# Altium schematic sheet DW1000.SchDoc: DecaWave DW1000
size A4; CompanyName: SPAN; Engineer: Anh Luong; Organization: University of Utah; Address1: 50 S Central Campus Dr; Address2: MEB Rm 3129; Address3: Salt Lake City, Utah 84115; Address4: USA; Revision: 1; SheetNumber: 1; SheetTotal: 2
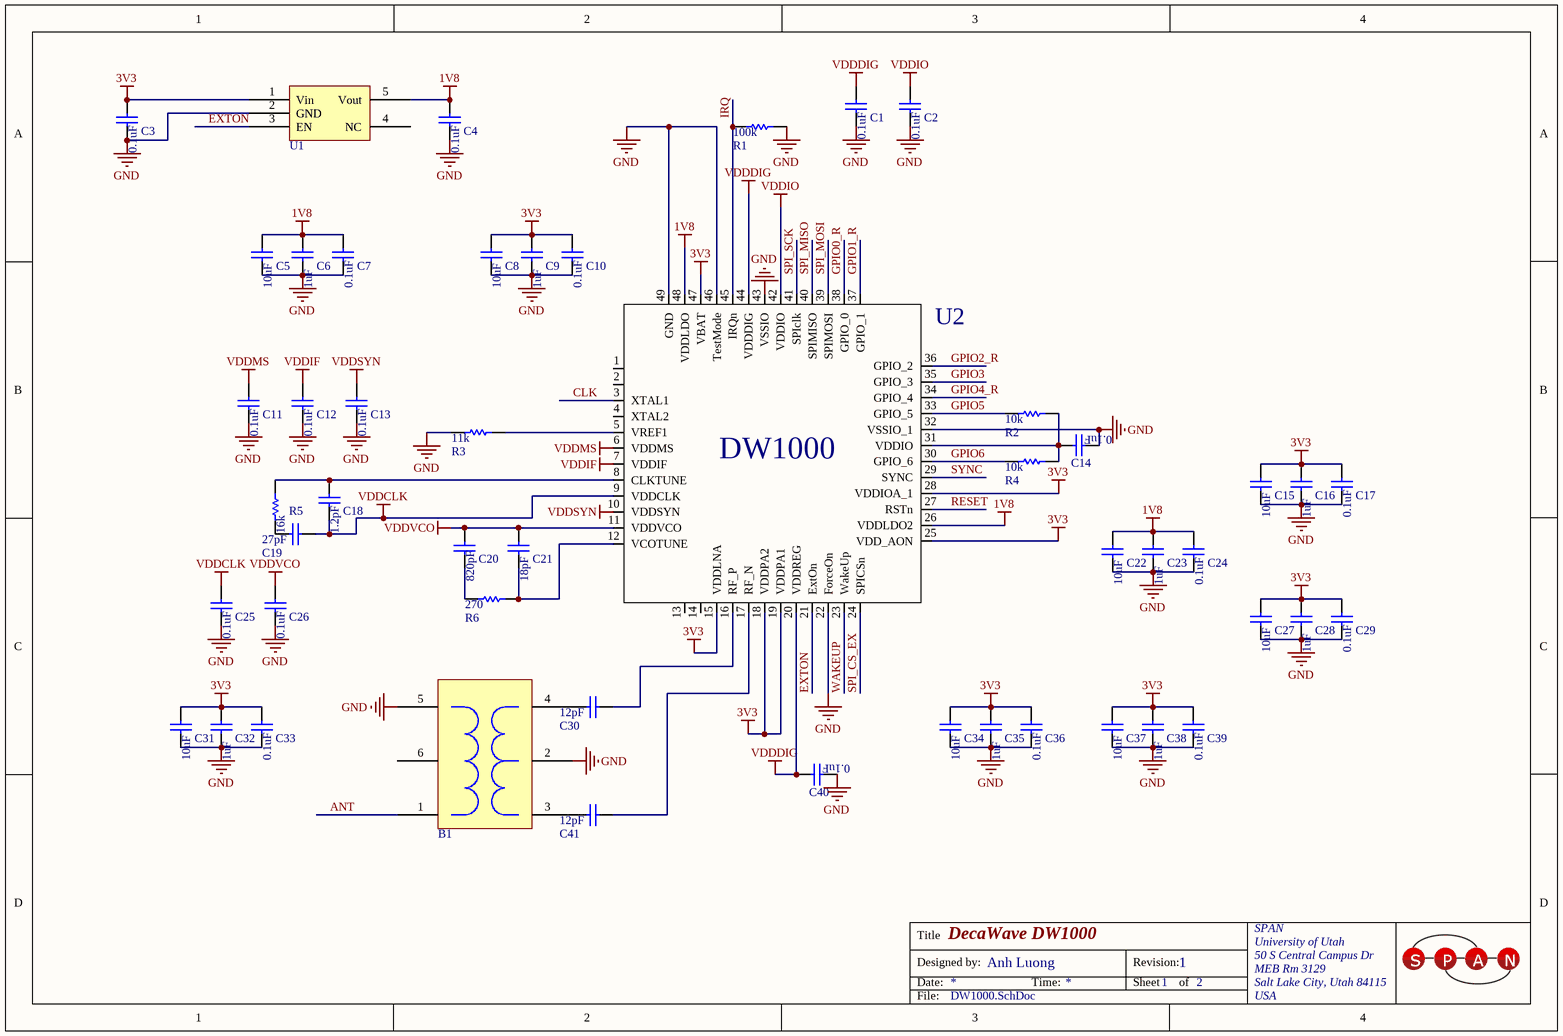
[diagram p0: DW1000.SchDoc]

## Parts
B1  HHM1595A1  [BALUN]  (value not drawn)
C1  GRM188R71C104KA01D  [CAPC1608X08N (0603)]  (value not drawn)
C2  GRM188R71C104KA01D  [CAPC1608X08N (0603)]  (value not drawn)
C3  GRM188R71C104KA01D  [CAPC1608X08N (0603)]  (value not drawn)
C4  GRM188R71C104KA01D  [CAPC1608X08N (0603)]  (value not drawn)
C5  GRM188R60J106ME47D  [CAPC1608X08N (0603)]  (value not drawn)
C6  GRM188R61A105KA61D  [CAPC1608X08N (0603)]  (value not drawn)
C7  GRM188R71C104KA01D  [CAPC1608X08N (0603)]  (value not drawn)
C8  GRM188R60J106ME47D  [CAPC1608X08N (0603)]  (value not drawn)
C9  GRM188R61A105KA61D  [CAPC1608X08N (0603)]  (value not drawn)
C10  GRM188R71C104KA01D  [CAPC1608X08N (0603)]  (value not drawn)
C11  GRM188R71C104KA01D  [CAPC1608X08N (0603)]  (value not drawn)
C12  GRM188R71C104KA01D  [CAPC1608X08N (0603)]  (value not drawn)
C13  GRM188R71C104KA01D  [CAPC1608X08N (0603)]  (value not drawn)
C14  GRM188R71C104KA01D  [CAPC1608X08N (0603)]  (value not drawn)
C15  GRM188R60J106ME47D  [CAPC1608X08N (0603)]  (value not drawn)
C16  GRM188R61A105KA61D  [CAPC1608X08N (0603)]  (value not drawn)
C17  GRM188R71C104KA01D  [CAPC1608X08N (0603)]  (value not drawn)
C18  GRM1885C1H1R2CA01D  [CAPC1608X08N (0603)]  (value not drawn)
C19  GRM1885C1H270JA01D  [CAPC1608X08N (0603)]  (value not drawn)
C20  GRM188R71H821KA01D  [CAPC1608X08N (0603)]  (value not drawn)
C21  GRM1885C1H180JA01D  [CAPC1608X08N (0603)]  (value not drawn)
C22  GRM188R60J106ME47D  [CAPC1608X08N (0603)]  (value not drawn)
C23  GRM188R61A105KA61D  [CAPC1608X08N (0603)]  (value not drawn)
C24  GRM188R71C104KA01D  [CAPC1608X08N (0603)]  (value not drawn)
C25  GRM188R71C104KA01D  [CAPC1608X08N (0603)]  (value not drawn)
C26  GRM188R71C104KA01D  [CAPC1608X08N (0603)]  (value not drawn)
C27  GRM188R60J106ME47D  [CAPC1608X08N (0603)]  (value not drawn)
C28  GRM188R61A105KA61D  [CAPC1608X08N (0603)]  (value not drawn)
C29  GRM188R71C104KA01D  [CAPC1608X08N (0603)]  (value not drawn)
C30  GRM1885C1H120JA01D  [CAPC1608X08N (0603)]  (value not drawn)
C31  GRM188R60J106ME47D  [CAPC1608X08N (0603)]  (value not drawn)
C32  GRM188R61A105KA61D  [CAPC1608X08N (0603)]  (value not drawn)
C33  GRM188R71C104KA01D  [CAPC1608X08N (0603)]  (value not drawn)
C34  GRM188R60J106ME47D  [CAPC1608X08N (0603)]  (value not drawn)
C35  GRM188R61A105KA61D  [CAPC1608X08N (0603)]  (value not drawn)
C36  GRM188R71C104KA01D  [CAPC1608X08N (0603)]  (value not drawn)
C37  GRM188R60J106ME47D  [CAPC1608X08N (0603)]  (value not drawn)
C38  GRM188R61A105KA61D  [CAPC1608X08N (0603)]  (value not drawn)
C39  GRM188R71C104KA01D  [CAPC1608X08N (0603)]  (value not drawn)
C40  GRM188R71C104KA01D  [CAPC1608X08N (0603)]  (value not drawn)
C41  GRM1885C1H120JA01D  [CAPC1608X08N (0603)]  (value not drawn)
R1  MCR03ERTJ104  [RESC1608X06N (0603)]  (value not drawn)
R2  MCR03ERTJ103  [RESC1608X06N (0603)]  (value not drawn)
R3  MCR03ERTJ113  [RESC1608X06N (0603)]  (value not drawn)
R4  MCR03ERTJ103  [RESC1608X06N (0603)]  (value not drawn)
R5  MCR03ERTJ163  [RESC1608X06N (0603)]  (value not drawn)
R6  MCR03ERTJ271  [RESC1608X06N (0603)]  (value not drawn)
U1  LP5907MFX-1.8/NOPB  [SOT95P280X145-5N]  (value not drawn)
U2  DW1000 IC  [QFN-48]  (value not drawn)

## Nets
1V8: C4.2 C5.2 C6.2 C7.2 C22.2 C23.2 C24.2 U1.5(Vout) U2.26(VDDLDO2) U2.48(VDDLDO)
3V3: C3.2 C8.2 C9.2 C10.2 C15.2 C16.2 C17.2 C27.2 C28.2 C29.2 C31.2 C32.2 C33.2 C34.2 C35.2 C36.2 C37.2 C38.2 C39.2 U1.1(Vin) U2.15(VDDLNA) U2.18(VDDPA2) U2.19(VDDPA1) U2.25(VDD_AON) U2.28(VDDIOA_1) U2.47(VBAT)
GND: B1.2 B1.5 C1.1 C2.1 C3.1 C4.1 C5.1 C6.1 C7.1 C8.1 C9.1 C10.1 C11.1 C12.1 C13.1 C14.1 C15.1 C16.1 C17.1 C22.1 C23.1 C24.1 C25.1 C26.1 C27.1 C28.1 C29.1 C31.1 C32.1 C33.1 C34.1 C35.1 C36.1 C37.1 C38.1 C39.1 C40.1 R1.2 R3.1 U1.2(GND) U2.22(ForceOn) U2.32(VSSIO_1) U2.43(VSSIO) U2.46(TestMode) U2.49(GND)
VDDCLK: C18.1 C19.2 C25.2 U2.9(VDDCLK)
VDDDIG: C1.2 C40.2 U2.20(VDDREG) U2.44(VDDDIG)
VDDIF: C12.2 U2.7(VDDIF)
VDDIO: C2.2 U2.42(VDDIO)
VDDMS: C11.2 U2.6(VDDMS)
VDDSYN: C13.2 U2.10(VDDSYN)
VDDVCO: C20.2 C21.2 C26.2 U2.11(VDDVCO)
ANT: B1.1
CLK: U2.3(XTAL1)
EXTON: U1.3(EN) U2.21(ExtOn)
GPIO0_R: U2.38(GPIO_0)
GPIO1_R: U2.37(GPIO_1)
GPIO2_R: U2.36(GPIO_2)
GPIO3: U2.35(GPIO_3)
GPIO4_R: U2.34(GPIO_4)
GPIO5: R2.1 U2.33(GPIO_5)
GPIO6: R4.1 U2.30(GPIO_6)
IRQ: R1.1 U2.45(IRQn)
RESET: U2.27(RSTn)
SPI_CS_EX: U2.24(SPICSn)
SPI_MISO: U2.40(SPIMISO)
SPI_MOSI: U2.39(SPIMOSI)
SPI_SCK: U2.41(SPIclk)
SYNC: U2.29(SYNC)
WAKEUP: U2.23(WakeUp)
NetB1_3: B1.3 C41.1
NetB1_4: B1.4 C30.1
NetC14_2: C14.2 R2.2 R4.2 U2.31(VDDIO)
NetC18_2: C18.2 R5.2 U2.8(CLKTUNE)
NetC19_1: C19.1 R5.1
NetC20_1: C20.1 R6.1
NetC21_1: C21.1 R6.2 U2.12(VCOTUNE)
NetC30_2: C30.2 U2.16(RF_P)
NetC41_2: C41.2 U2.17(RF_N)
NetR3_2: R3.2 U2.5(VREF1)

Not connected (* = marked no-connect by the designer): B1 6; U1 4(NC); U2 1 2 4(XTAL2) 13 14

## Notes on the sheet
- Title
- Designed by:
- Date:
- Time:
- Revision:
- Sheet
- of
- File:
- (in symbol DW1000_QFN_48) DW1000
- (in symbol GRM188R60J106ME47D) 10uF
- (in symbol GRM188R61A105KA61D) 1uF
- (in symbol GRM188R71C104KA01D) 0.1uF

## Library data of the parts
B1 = HHM1595A1: XFMR BALUN RF 3.0-8.0GHZ UWB SMD; Manufacturer: TDK Corporation; Frequency Range: 3GHz ~ 8GHz; Impedance - Unbalanced/Balanced: 50 / 100 Ohm; Phase Difference: 180° ±20; Insertion Loss (Max): 1.5dB; Return Loss (Min): 8dB; Supplier 1: Digi-Key; Manufacturer Part Number: HHM1595A1; RoHS: RoHS Compliant; Category: RF/IF and RFID; Stock 1: 20610; Pricing 1: 1=1.38, 10=1.348, 100=0.7356, 250=0.66, 500=0.64626, 1000=0.4675 (USD); Packaging: Cut Tape (CT); Part Status: Active; Package / Case: 0805 (2012 Metric); Mounting Type: Surface Mount; ComponentLink1URL: https://product.tdk.com/info/en/documents/data_sheet/rf_balun_hhm1595a1_en.pdf; ComponentLink1Description: https://product.tdk.com/info/en/documents/data_sheet/rf_balun_hhm1595a1_en.pdf; Supplier Part Number 1: 445-3387-1-ND
C1-C4 C7 C10-C14 C17 C24-C26 C29 C33 C36 C39 C40 = GRM188R71C104KA01D: CAP CER 0.1UF 16V 10% X7R 0603; Manufacturer: Murata Electronics North America; Capacitance: 0.1µF; Supplier 1: Digi-Key; Manufacturer Part Number: GRM188R71C104KA01D; RoHS: RoHS Compliant; Category: Capacitors; Stock 1: 1458181; Pricing 1: 1=0.1, 10=0.019, 50=0.0102, 100=0.0086, 250=0.00704, 500=0.006, 1000=0.00468 (USD); Packaging: Cut Tape (CT); Tolerance: ±10%; Voltage - Rated: 16V; Temperature Coefficient: X7R; Mounting Type: Surface Mount, MLCC; Operating Temperature: -55°C ~ 125°C; Applications: General Purpose; Ratings: -; Package / Case: 0603 (1608 Metric); Size / Dimension: 0.063" L x 0.031" W (1.60mm x 0.80mm); Height - Seated (Max): -; Thickness (Max): 0.035" (0.90mm); Lead Spacing: -; Features: -; Lead Style: -; ComponentLink1URL: http://search.murata.co.jp/Ceramy/image/img/A01X/G101/ENG/GRM188R71C104KA01-01.pdf; ComponentLink1Description: http://search.murata.co.jp/Ceramy/image/img/A01X/G101/ENG/GRM188R71C104KA01-01.pdf
C5 C8 C15 C22 C27 C31 C34 C37 = GRM188R60J106ME47D: CAP CER 10UF 6.3V 20% X5R 0603; Manufacturer: Murata Electronics North America; Capacitance: 10µF; Supplier 1: Digi-Key; Manufacturer Part Number: GRM188R60J106ME47D; RoHS: RoHS Compliant; Category: Capacitors; Stock 1: 2128324; Pricing 1: 1=0.24, 10=0.2, 50=0.1126, 100=0.1, 250=0.075, 500=0.06626, 1000=0.05875 (USD); Packaging: Digi-Reel®; Voltage - Rated: 6.3V; Tolerance: ±20%; Temperature Coefficient: X5R; Mounting Type: Surface Mount, MLCC; Operating Temperature: -55°C ~ 85°C; Applications: General Purpose; Ratings: -; Package / Case: 0603 (1608 Metric); Size / Dimension: 0.063" L x 0.031" W (1.60mm x 0.80mm); Height - Seated (Max): -; Thickness (Max): 0.035" (0.90mm); Lead Spacing: -; Features: -; Lead Style: -; ComponentLink1URL: http://search.murata.co.jp/Ceramy/image/img/A01X/G101/ENG/GRM188R60J106ME47-01.pdf; ComponentLink1Description: http://search.murata.co.jp/Ceramy/image/img/A01X/G101/ENG/GRM188R60J106ME47-01.pdf; Supplier 2: Digi-Key
C6 C9 C16 C23 C28 C32 C35 C38 = GRM188R61A105KA61D: CAP CER 1UF 10V 10% X5R 0603; Manufacturer: Murata Electronics North America; Capacitance: 1.0µF; Supplier 1: Digi-Key; Manufacturer Part Number: GRM188R61A105KA61D; RoHS: RoHS Compliant; Category: Capacitors; Stock 1: 244919; Pricing 1: 1=0.1, 10=0.041, 50=0.0224, 100=0.019, 250=0.01552, 500=0.01328, 1000=0.01035 (USD); Packaging: Cut Tape (CT); Voltage - Rated: 10V; Tolerance: ±10%; Temperature Coefficient: X5R; Mounting Type: Surface Mount, MLCC; Operating Temperature: -55°C ~ 85°C; Applications: General Purpose; Ratings: -; Package / Case: 0603 (1608 Metric); Size / Dimension: 0.063" L x 0.031" W (1.60mm x 0.80mm); Height - Seated (Max): -; Thickness (Max): 0.035" (0.90mm); Lead Spacing: -; Features: -; Lead Style: -; ComponentLink1URL: http://search.murata.co.jp/Ceramy/image/img/A01X/G101/ENG/GRM188R61A105KA61-01.pdf; ComponentLink1Description: http://search.murata.co.jp/Ceramy/image/img/A01X/G101/ENG/GRM188R61A105KA61-01.pdf
C18 = GRM1885C1H1R2CA01D: CAP CER 1.2PF 50V NP0 0603; Manufacturer: Murata Electronics North America; Tolerance: ±0.25pF; Temperature Coefficient: C0G, NP0; Supplier 1: Digi-Key; Manufacturer Part Number: GRM1885C1H1R2CA01D; RoHS: RoHS Compliant; Category: Capacitors; Stock 1: 36680; Pricing 1: 1=0.1, 10=0.053, 50=0.0286, 100=0.0242, 250=0.0198, 500=0.01694, 1000=0.0132 (USD); Packaging: Cut Tape (CT); Part Status: Active; Capacitance: 1.2pF; Voltage - Rated: 50V; Operating Temperature: -55°C ~ 125°C; Features: -; Ratings: -; Applications: General Purpose; Failure Rate: *; Mounting Type: Surface Mount, MLCC; Package / Case: 0603 (1608 Metric); Size / Dimension: 0.063" L x 0.031" W (1.60mm x 0.80mm); Height - Seated (Max): -; Thickness (Max): 0.035" (0.90mm); Lead Spacing: -; Lead Style: -; ComponentLink1URL: http://www.murata.com/~/media/webrenewal/support/library/catalog/products/capacitor/mlcc/c02e.pdf; ComponentLink1Description: http://www.murata.com/~/media/webrenewal/support/library/catalog/products/capacitor/mlcc/c02e.pdf; Supplier Part Number 1: 490-10709-1-ND
C19 = GRM1885C1H270JA01D: CAP CER 27PF 50V NP0 0603; Manufacturer: Murata Electronics North America; Tolerance: ±5%; Temperature Coefficient: C0G, NP0; Supplier 1: Digi-Key; Manufacturer Part Number: GRM1885C1H270JA01D; RoHS: RoHS Compliant; Category: Capacitors; Stock 1: 113117; Pricing 1: 1=0.1, 10=0.041, 50=0.0222, 100=0.0187, 250=0.01532, 500=0.0131, 1000=0.0102 (USD); Packaging: Cut Tape (CT); Part Status: Active; Capacitance: 27pF; Voltage - Rated: 50V; Operating Temperature: -55°C ~ 125°C; Features: -; Ratings: -; Applications: General Purpose; Failure Rate: *; Mounting Type: Surface Mount, MLCC; Package / Case: 0603 (1608 Metric); Size / Dimension: 0.063" L x 0.031" W (1.60mm x 0.80mm); Height - Seated (Max): -; Thickness (Max): 0.035" (0.90mm); Lead Spacing: -; Lead Style: -; ComponentLink1URL: http://www.murata.com/~/media/webrenewal/support/library/catalog/products/capacitor/mlcc/c02e.pdf; ComponentLink1Description: http://www.murata.com/~/media/webrenewal/support/library/catalog/products/capacitor/mlcc/c02e.pdf; Supplier Part Number 1: 490-1413-1-ND
C20 = GRM188R71H821KA01D: CAP CER 820PF 50V X7R 0603; Manufacturer: Murata Electronics North America; Tolerance: ±10%; Supplier 1: Digi-Key; Manufacturer Part Number: GRM188R71H821KA01D; RoHS: RoHS Compliant; Category: Capacitors; Stock 1: 61936; Pricing 1: 1=0.1, 10=0.067, 25=0.0476, 50=0.0364, 100=0.0308, 250=0.0252, 500=0.02156, 1000=0.0168 (USD); Packaging: Cut Tape (CT); Part Status: Active; Capacitance: 820pF; Voltage - Rated: 50V; Temperature Coefficient: X7R; Operating Temperature: -55°C ~ 125°C; Features: -; Ratings: -; Applications: General Purpose; Failure Rate: *; Mounting Type: Surface Mount, MLCC; Package / Case: 0603 (1608 Metric); Size / Dimension: 0.063" L x 0.031" W (1.60mm x 0.80mm); Height - Seated (Max): -; Thickness (Max): 0.035" (0.90mm); Lead Spacing: -; Lead Style: -; ComponentLink1URL: http://www.murata.com/~/media/webrenewal/support/library/catalog/products/capacitor/mlcc/c02e.pdf; ComponentLink1Description: http://www.murata.com/~/media/webrenewal/support/library/catalog/products/capacitor/mlcc/c02e.pdf; Supplier Part Number 1: 490-1493-1-ND
C21 = GRM1885C1H180JA01D: CAP CER 18PF 50V NP0 0603; Manufacturer: Murata Electronics North America; Tolerance: ±5%; Temperature Coefficient: C0G, NP0; Supplier 1: Digi-Key; Manufacturer Part Number: GRM1885C1H180JA01D; RoHS: RoHS Compliant; Category: Capacitors; Stock 1: 281577; Pricing 1: 1=0.1, 10=0.041, 50=0.0222, 100=0.0187, 250=0.01532, 500=0.0131, 1000=0.0102 (USD); Packaging: Cut Tape (CT); Part Status: Active; Capacitance: 18pF; Voltage - Rated: 50V; Operating Temperature: -55°C ~ 125°C; Features: -; Ratings: -; Applications: General Purpose; Failure Rate: *; Mounting Type: Surface Mount, MLCC; Package / Case: 0603 (1608 Metric); Size / Dimension: 0.063" L x 0.031" W (1.60mm x 0.80mm); Height - Seated (Max): -; Thickness (Max): 0.035" (0.90mm); Lead Spacing: -; Lead Style: -; ComponentLink1URL: http://www.murata.com/~/media/webrenewal/support/library/catalog/products/capacitor/mlcc/c02e.pdf; ComponentLink1Description: http://www.murata.com/~/media/webrenewal/support/library/catalog/products/capacitor/mlcc/c02e.pdf; Supplier Part Number 1: 490-1409-1-ND
C30 C41 = GRM1885C1H120JA01D: CAP CER 12PF 50V NP0 0603; Manufacturer: Murata Electronics North America; Tolerance: ±5%; Temperature Coefficient: C0G, NP0; Supplier 1: Digi-Key; Manufacturer Part Number: GRM1885C1H120JA01D; RoHS: RoHS Compliant; Category: Capacitors; Stock 1: 151484; Pricing 1: 1=0.1, 10=0.041, 50=0.0222, 100=0.0187, 250=0.01532, 500=0.0131, 1000=0.0102 (USD); Packaging: Cut Tape (CT); Part Status: Active; Capacitance: 12pF; Voltage - Rated: 50V; Operating Temperature: -55°C ~ 125°C; Features: -; Ratings: -; Applications: General Purpose; Failure Rate: *; Mounting Type: Surface Mount, MLCC; Package / Case: 0603 (1608 Metric); Size / Dimension: 0.063" L x 0.031" W (1.60mm x 0.80mm); Height - Seated (Max): -; Thickness (Max): 0.035" (0.90mm); Lead Spacing: -; Lead Style: -; ComponentLink1URL: http://www.murata.com/~/media/webrenewal/support/library/catalog/products/capacitor/mlcc/c02e.pdf; ComponentLink1Description: http://www.murata.com/~/media/webrenewal/support/library/catalog/products/capacitor/mlcc/c02e.pdf; Supplier Part Number 1: 490-1405-1-ND
R1 = MCR03ERTJ104: RES SMD 100K OHM 5% 1/10W 0603; Manufacturer: Rohm Semiconductor; Power (Watts): 0.1W, 1/10W; Temperature Coefficient: ±200ppm/°C; Supplier 1: Digi-Key; Manufacturer Part Number: MCR03ERTJ104; RoHS: RoHS Compliant; Category: Resistors; Stock 1: 136580; Pricing 1: 1=0.1, 10=0.019, 25=0.0132, 100=0.0075, 250=0.00576, 500=0.0046, 1000=0.00338 (USD); Packaging: Cut Tape (CT); Part Status: Active; Resistance (Ohms): 100k; Tolerance: ±5%; Composition: Thick Film; Features: -; Operating Temperature: -55°C ~ 155°C; Package / Case: 0603 (1608 Metric); Supplier Device Package: 0603; Size / Dimension: 0.063" L x 0.031" W (1.60mm x 0.80mm); Height: 0.022" (0.55mm); Number of Terminations: 2; Failure Rate: -; ComponentLink1URL: http://rohmfs.rohm.com/en/products/databook/datasheet/passive/resistor/chip_resistor/mcr_g.pdf; ComponentLink1Description: http://rohmfs.rohm.com/en/products/databook/datasheet/passive/resistor/chip_resistor/mcr_g.pdf; Supplier Part Number 1: RHM100KCGCT-ND
R2 R4 = MCR03ERTJ103: RES 10K OHM 1/10W 5% 0603 SMD; Manufacturer: Rohm Semiconductor; Power (Watts): 0.1W, 1/10W; Temperature Coefficient: ±200ppm/°C; Supplier 1: Digi-Key; Manufacturer Part Number: MCR03ERTJ103; RoHS: RoHS Compliant; Category: Resistors; Stock 1: 330000; Pricing 1: 5000=0.00103, 10000=0.00089, 25000=0.00078, 50000=0.00072, 125000=0.0007 (USD); Packaging: Tape & Reel (TR); Resistance (Ohms): 10k; Tolerance: ±5%; Composition: Thick Film; Features: -; Package / Case: 0603 (1608 Metric); Supplier Device Package: 0603 (1608 Metric); Size / Dimension: 0.063" L x 0.031" W (1.60mm x 0.80mm); Height: 0.022" (0.55mm); Number of Terminations: 2; ComponentLink1URL: http://rohmfs.rohm.com/en/products/databook/datasheet/passive/resistor/chip_resistor/mcr_g.pdf; ComponentLink1Description: http://rohmfs.rohm.com/en/products/databook/datasheet/passive/resistor/chip_resistor/mcr_g.pdf
R3 = MCR03ERTJ113: RES SMD 11K OHM 5% 1/10W 0603; Manufacturer: Rohm Semiconductor; Power (Watts): 0.1W, 1/10W; Temperature Coefficient: ±200ppm/°C; Supplier 1: Digi-Key; Manufacturer Part Number: MCR03ERTJ113; RoHS: RoHS Compliant; Category: Resistors; Stock 1: 8319; Pricing 1: 1=0.1, 10=0.019, 25=0.0132, 100=0.0075, 250=0.00576, 500=0.0046, 1000=0.00338 (USD); Packaging: Cut Tape (CT); Part Status: Active; Resistance (Ohms): 11k; Tolerance: ±5%; Composition: Thick Film; Features: -; Operating Temperature: -55°C ~ 155°C; Package / Case: 0603 (1608 Metric); Supplier Device Package: 0603; Size / Dimension: 0.063" L x 0.031" W (1.60mm x 0.80mm); Height: 0.022" (0.55mm); Number of Terminations: 2; Failure Rate: -; ComponentLink1URL: http://rohmfs.rohm.com/en/products/databook/datasheet/passive/resistor/chip_resistor/mcr_g.pdf; ComponentLink1Description: http://rohmfs.rohm.com/en/products/databook/datasheet/passive/resistor/chip_resistor/mcr_g.pdf; Supplier Part Number 1: RHM11KCGCT-ND
R5 = MCR03ERTJ163: RES SMD 16K OHM 5% 1/10W 0603; Manufacturer: Rohm Semiconductor; Power (Watts): 0.1W, 1/10W; Temperature Coefficient: ±200ppm/°C; Supplier 1: Digi-Key; Manufacturer Part Number: MCR03ERTJ163; RoHS: RoHS Compliant; Category: Resistors; Stock 1: 7457; Pricing 1: 1=0.1, 10=0.019, 25=0.0132, 100=0.0075, 250=0.00576, 500=0.0046, 1000=0.00338 (USD); Packaging: Cut Tape (CT); Part Status: Active; Resistance (Ohms): 16k; Tolerance: ±5%; Composition: Thick Film; Features: -; Operating Temperature: -55°C ~ 155°C; Package / Case: 0603 (1608 Metric); Supplier Device Package: 0603; Size / Dimension: 0.063" L x 0.031" W (1.60mm x 0.80mm); Height: 0.022" (0.55mm); Number of Terminations: 2; Failure Rate: -; ComponentLink1URL: http://rohmfs.rohm.com/en/products/databook/datasheet/passive/resistor/chip_resistor/mcr_g.pdf; ComponentLink1Description: http://rohmfs.rohm.com/en/products/databook/datasheet/passive/resistor/chip_resistor/mcr_g.pdf; Supplier Part Number 1: RHM16KCGCT-ND
R6 = MCR03ERTJ271: RES SMD 270 OHM 5% 1/10W 0603; Manufacturer: Rohm Semiconductor; Resistance (Ohms): 270; Power (Watts): 0.1W, 1/10W; Temperature Coefficient: ±200ppm/°C; Supplier 1: Digi-Key; Manufacturer Part Number: MCR03ERTJ271; RoHS: RoHS Compliant; Category: Resistors; Stock 1: 34918; Pricing 1: 1=0.1, 10=0.019, 25=0.0132, 100=0.0075, 250=0.00576, 500=0.0046, 1000=0.00338 (USD); Packaging: Cut Tape (CT); Part Status: Active; Tolerance: ±5%; Composition: Thick Film; Features: -; Operating Temperature: -55°C ~ 155°C; Package / Case: 0603 (1608 Metric); Supplier Device Package: 0603; Size / Dimension: 0.063" L x 0.031" W (1.60mm x 0.80mm); Height: 0.022" (0.55mm); Number of Terminations: 2; Failure Rate: -; ComponentLink1URL: http://rohmfs.rohm.com/en/products/databook/datasheet/passive/resistor/chip_resistor/mcr_g.pdf; ComponentLink1Description: http://rohmfs.rohm.com/en/products/databook/datasheet/passive/resistor/chip_resistor/mcr_g.pdf; Supplier Part Number 1: RHM270CGCT-ND
U1 = LP5907MFX-1.8/NOPB: IC REG LDO 1.8V 0.25A SOT23-5; Manufacturer: Texas Instruments; Regulator Topology: Positive Fixed; Current - Output: 250mA; Number of Regulators: 1; Voltage - Input: 2.2 V ~ 5.5 V; Supplier 1: Digi-Key; Manufacturer Part Number: LP5907MFX-1.8/NOPB; RoHS: RoHS Compliant; Category: Integrated Circuits (ICs); Stock 1: 13246; Pricing 1: 1=0.57, 10=0.488, 100=0.3641, 500=0.28602, 1000=0.1575 (USD); Packaging: Cut Tape (CT); Part Status: Active; Voltage - Output: 1.8V; Voltage - Dropout (Typical): -; Current - Limit (Min): -; Operating Temperature: -40°C ~ 125°C; Mounting Type: Surface Mount; Package / Case: SC-74A, SOT-753; Supplier Device Package: SOT-23; ComponentLink1URL: http://www.ti.com/lit/ds/symlink/lp5907.pdf; ComponentLink1Description: http://www.ti.com/lit/ds/symlink/lp5907.pdf; Supplier Part Number 1: 296-41463-1-ND
U2 = DW1000_QFN_48: UWB DW1000; Manufacturer: Decawave Ltd.; Part Number: DW1000_QFN; Component Code: n/a; Component Type: Standard; Cost: *; Footprint: QFN_48; ComponentLink1Description: Datasheet Link